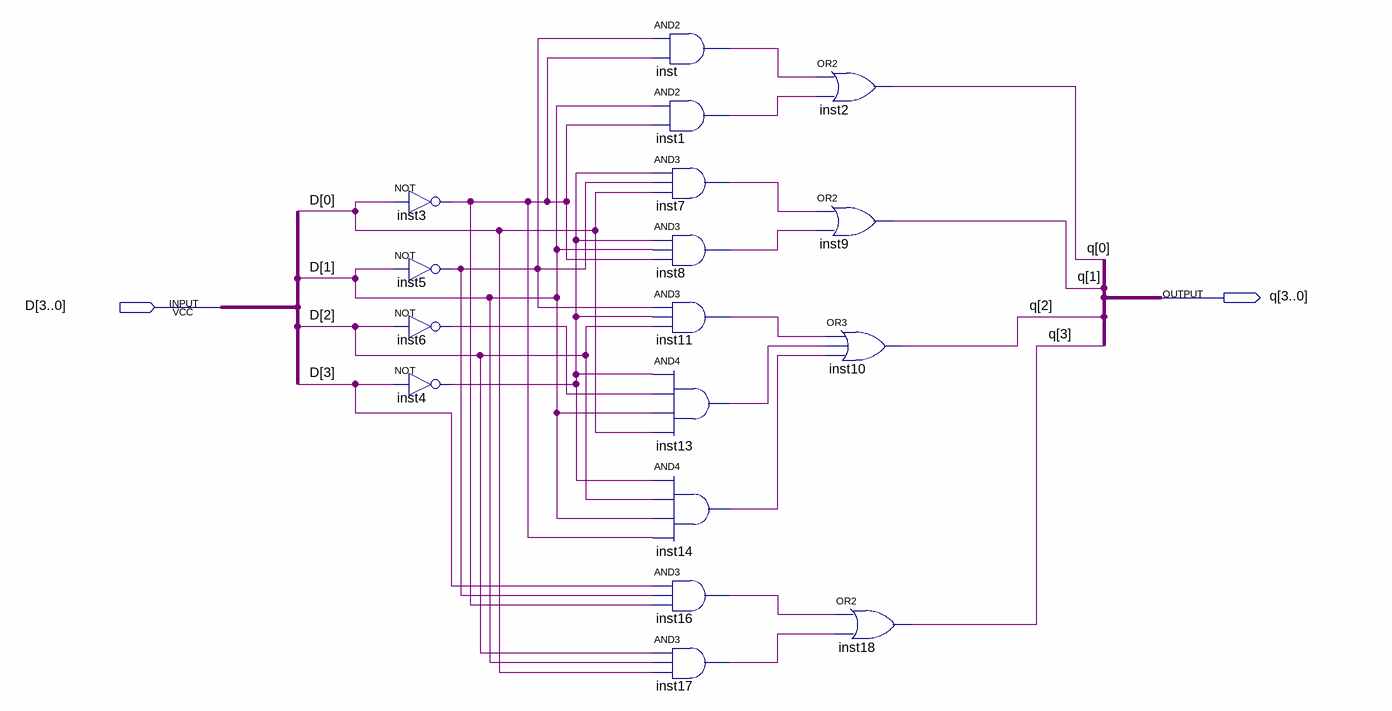
[diagram p0: schematic sheet]
// Quartus schematic counterlogic.bdf as structural Verilog: 17 symbols, 2 pins
module counterlogic (
  input  [3:0] D,
  output [3:0] q
);

  wire inst1_out, inst3_out, inst4_out, inst5_out, inst6_out, inst7_out, inst8_out, inst11_out, inst13_out,
       inst14_out, inst16_out, inst17_out, inst_out;

  not inst3 (inst3_out, D[0]);
  not inst5 (inst5_out, D[1]);
  not inst6 (inst6_out, D[2]);
  not inst4 (inst4_out, D[3]);
  and inst (inst_out, inst5_out, inst3_out);
  and inst1 (inst1_out, D[1], inst3_out);
  and inst7 (inst7_out, inst4_out, inst5_out, D[0]);
  and inst8 (inst8_out, inst4_out, D[1], inst3_out);
  and inst11 (inst11_out, inst5_out, inst4_out, D[2]);
  and inst13 (inst13_out, inst4_out, inst6_out, D[1], D[0]);
  and inst14 (inst14_out, inst4_out, D[2], D[1], inst3_out);
  and inst16 (inst16_out, D[3], inst5_out, inst3_out);
  and inst17 (inst17_out, D[2], D[1], D[0]);
  or inst2 (q[0], inst_out, inst1_out);
  or inst9 (q[1], inst7_out, inst8_out);
  or inst10 (q[2], inst11_out, inst13_out, inst14_out);
  or inst18 (q[3], inst16_out, inst17_out);
endmodule
